# EAGLE design APRS (EAGLE 6.2)
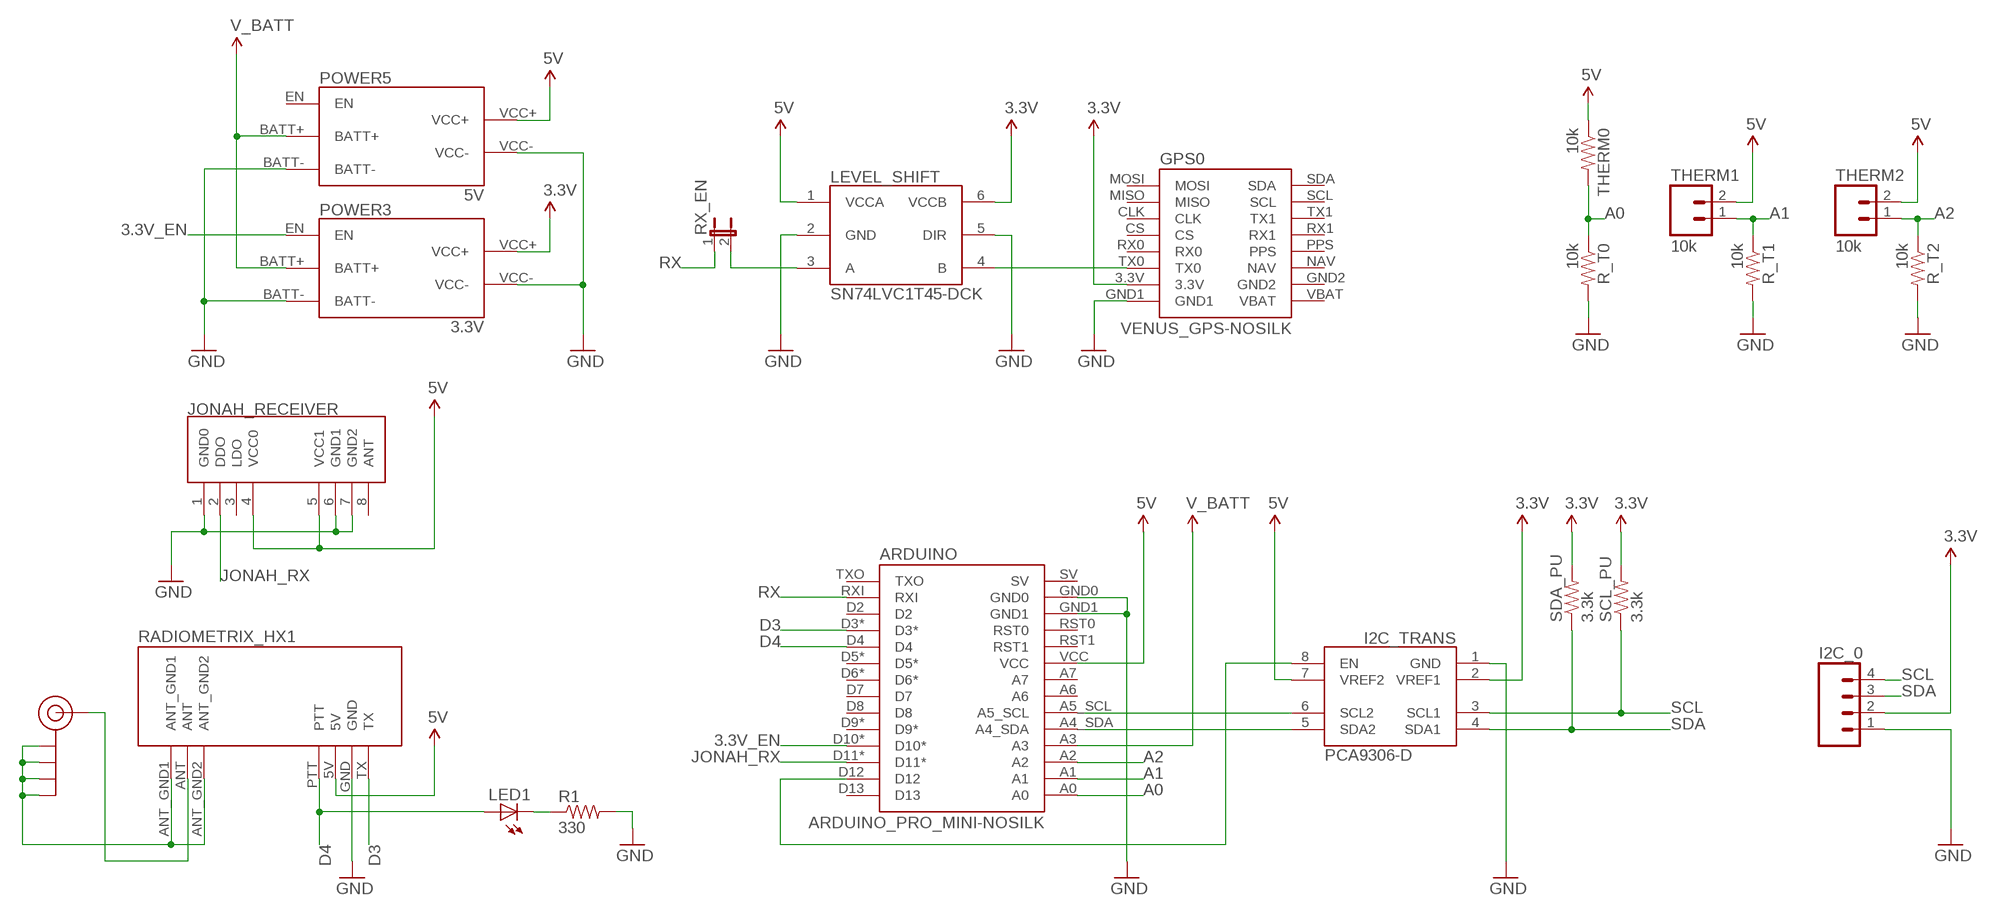
[diagram p0: schematic, sheet 1]

## Parts
ARDUINO  ARDUINO_PRO_MINI-NOSILK  [ARDUINO_PRO_MINI-NOSILK]
GPS0  VENUS_GPS-NOSILK  [VENUS_GPS-NOSILK]
I2C_0  M04PTH  [1X04]
I2C_TRANS  PCA9306-D  [SO8]
J$1  SMA_EDGE  [SMA-EDGE]
JONAH_RECEIVER  RADIO-KLP-RECEIVER-NOSILK  [RADIO-KLP-RECEIVER-NOSILK]
LED1  LED0603  [LED-0603]
LEVEL_SHIFT  SN74LVC1T45-DCK  [SC70]
POWER3  3.3V  POWER-TPS6300X-NOSILK  [POWER-TPS6300X-NOSILK]
POWER5  5V  POWER-TPS6300X-NOSILK  [POWER-TPS6300X-NOSILK]
R1  330  RESISTOR0805-RES  [0805]
R_T0  10k  RESISTOR0805-RES  [0805]
R_T1  10k  RESISTOR0805-RES  [0805]
R_T2  10k  RESISTOR0805-RES  [0805]
RADIOMETRIX_HX1  RADIOMETRIX-HX1  [RADIOMETRIX-HX1]
RX_EN  JUMPER-2PTH  [1X02]
SCL_PU  3.3k  RESISTOR0805-RES  [0805]
SDA_PU  3.3k  RESISTOR0805-RES  [0805]
THERM0  10k  RESISTOR0805-RES  [0805]
THERM1  10k  M02JST-PTH-2  [JST-2-PTH]
THERM2  10k  M02JST-PTH-2  [JST-2-PTH]

## Nets
1.8V: ARDUINO.A3 POWER3.BATT+ POWER5.BATT+ ; supply symbol labelled V_BATT
3.3V: GPS0.3.3V I2C_0.2 I2C_TRANS.2(VREF1) LEVEL_SHIFT.6(VCCB) POWER3.VCC+ SCL_PU.2 SDA_PU.2
3.3V_EN: ARDUINO.D10* POWER3.EN
5V: ARDUINO.VCC I2C_TRANS.7(VREF2) JONAH_RECEIVER.4(VCC0) JONAH_RECEIVER.5(VCC1) LEVEL_SHIFT.1(VCCA) POWER5.VCC+ RADIOMETRIX_HX1.5V THERM0.1 THERM1.2 THERM2.2
A0: ARDUINO.A0 R_T0.1 THERM0.2
A1: ARDUINO.A1 R_T1.1 THERM1.1
A2: ARDUINO.A2 R_T2.1 THERM2.1
D3: ARDUINO.D3* RADIOMETRIX_HX1.TX
D4: ARDUINO.D4 LED1.A RADIOMETRIX_HX1.PTT
GND: ARDUINO.GND0 ARDUINO.GND1 GPS0.GND1 I2C_0.1 I2C_TRANS.1(GND) JONAH_RECEIVER.1(GND0) JONAH_RECEIVER.6(GND1) JONAH_RECEIVER.7(GND2) LEVEL_SHIFT.2(GND) LEVEL_SHIFT.5(DIR) POWER3.BATT- POWER3.VCC- POWER5.BATT- POWER5.VCC- R1.2 R_T0.2 R_T1.2 R_T2.2 RADIOMETRIX_HX1.GND
JONAH_RX: ARDUINO.D11* JONAH_RECEIVER.2(DDO)
N$1: J$1.GND@0(GND) J$1.GND@1(GND) J$1.GND@2(GND) J$1.GND@3(GND) RADIOMETRIX_HX1.ANT_GND1 RADIOMETRIX_HX1.ANT_GND2
N$2: J$1.SIG(SIGNAL) RADIOMETRIX_HX1.ANT
N$3: GPS0.TX0 LEVEL_SHIFT.4(B)
N$4: ARDUINO.A4_SDA I2C_TRANS.5(SDA2)
N$5: ARDUINO.A5_SCL I2C_TRANS.6(SCL2)
N$6: ARDUINO.D12 I2C_TRANS.8(EN)
N$7: LEVEL_SHIFT.3(A) RX_EN.2
N$11: LED1.C R1.1
RX: ARDUINO.RXI RX_EN.1
SCL: I2C_0.4 I2C_TRANS.3(SCL1) SCL_PU.1
SDA: I2C_0.3 I2C_TRANS.4(SDA1) SDA_PU.1
Unconnected: ARDUINO.A6 ARDUINO.A7 ARDUINO.D2 ARDUINO.D5* ARDUINO.D6* ARDUINO.D7 ARDUINO.D8 ARDUINO.D9* ARDUINO.D13 ARDUINO.RST0 ARDUINO.RST1 ARDUINO.SV ARDUINO.TXO GPS0.CLK GPS0.CS GPS0.GND2 GPS0.MISO GPS0.MOSI GPS0.NAV GPS0.PPS GPS0.RX0 GPS0.RX1 GPS0.SCL GPS0.SDA GPS0.TX1 GPS0.VBAT JONAH_RECEIVER.3(LDO) JONAH_RECEIVER.8(ANT) POWER5.EN

## Library data of the parts
ARDUINO = OpenSpace:ARDUINO_PRO_MINI
GPS0 = OpenSpace:VENUS_GPS
I2C_0 = SparkFun-Connectors:M04: Header 4 Standard 4-pin 0.1" header. Use with straight break away headers (SKU : PRT-00116), right angle break away headers (PRT-00553), swiss pins (PRT-00743), machine pins (PRT-00117), and female headers (PRT-00115). Molex polarized connector foot print use with SKU : PRT-08231 with associated crimp pins and housings. 1MM SMD Version SKU: PRT-10208
I2C_TRANS = OpenSpace:PCA9306
J$1 = SparkFun:SMA_EDGE: SMA Antenna Connector End launch SMA connector. The paste layer has been removed so that the connector can be hand soldered onto the board after reflow.
JONAH_RECEIVER = OpenSpace:RADIO-KLP-RECEIVER
LED1 = SparkFun-LED:LED: LEDs Standard schematic elements and footprints for 5mm, 3mm, 1206, and 0603 sized LEDs. 5mm - Spark Fun Electronics SKU : COM-00529 (and others)
LEVEL_SHIFT = OpenSpace:SN74LVC1T45
POWER3 POWER5 = OpenSpace:POWER
R1 R_T0 R_T1 R_T2 SCL_PU SDA_PU THERM0 = SparkFun-Passives:RESISTOR: Resistor Basic schematic elements and footprints for 0603, 1206, and PTH resistors.
RADIOMETRIX_HX1 = OpenSpace:RADIOMETRIX-HX1
RX_EN = SparkFun-Passives:JUMPER-2: Jumper Basic 0.1" spaced jumper. Use with breakaway headers.
THERM1 THERM2 = SparkFun-Connectors:M02: Header 2 Standard 2-pin 0.1" header. Use with straight break away headers (SKU : PRT-00116), right angle break away headers (PRT-00553), swiss pins (PRT-00743), machine pins (PRT-00117), and female headers (PRT-00115). Molex polarized connector foot print use with SKU : PRT-08233 with associated crimp pins and housings.

## Board
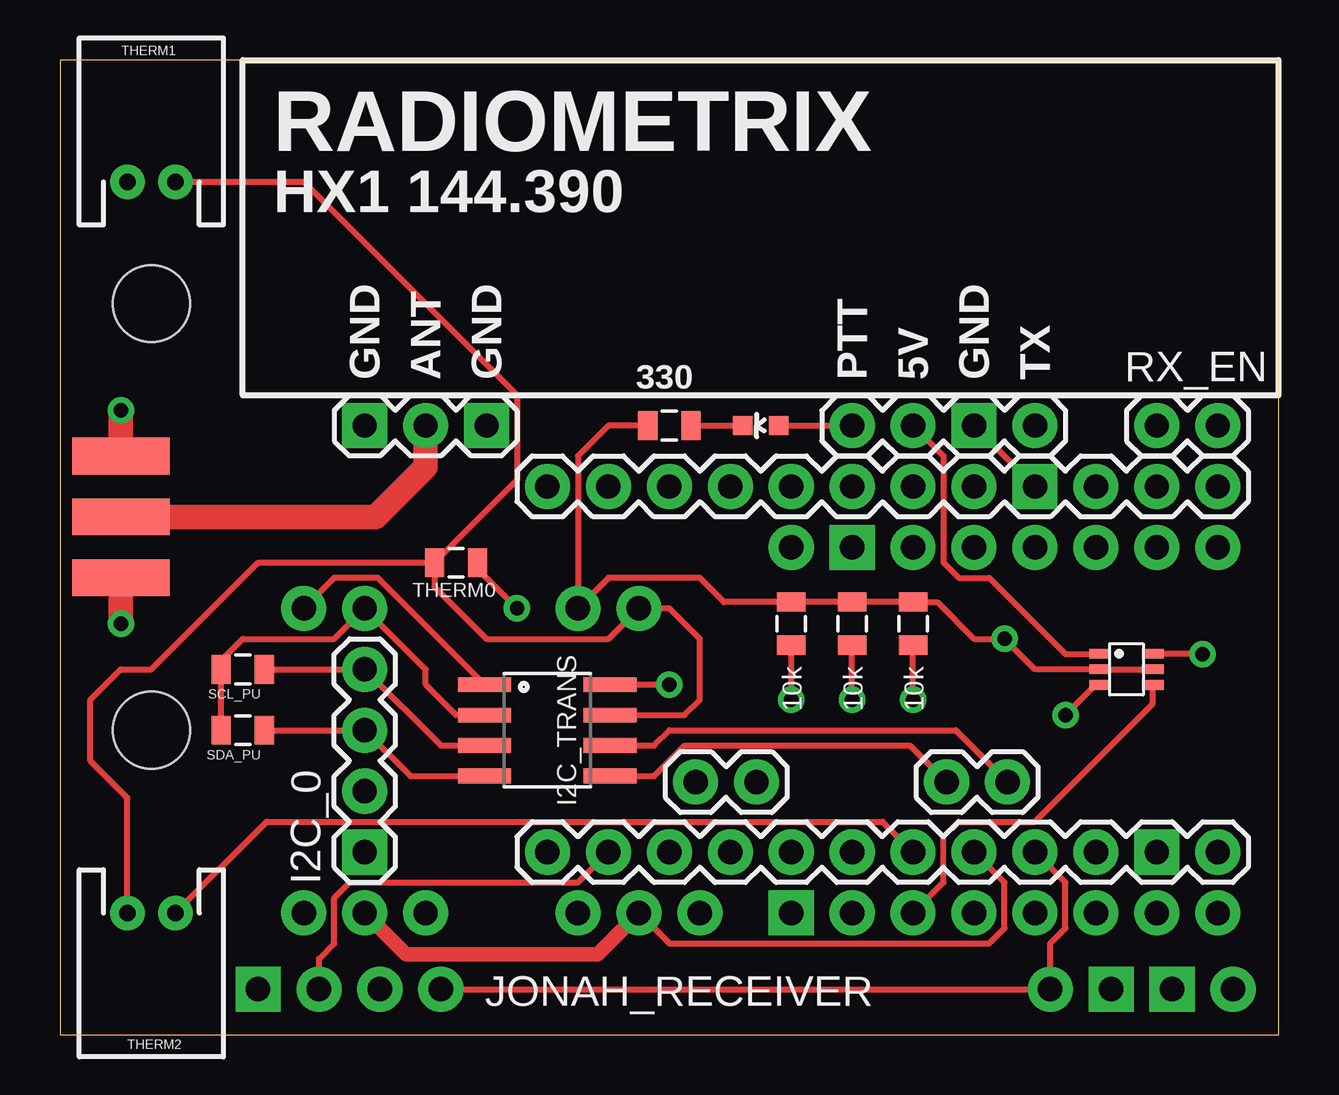
[diagram p1: board, top side]
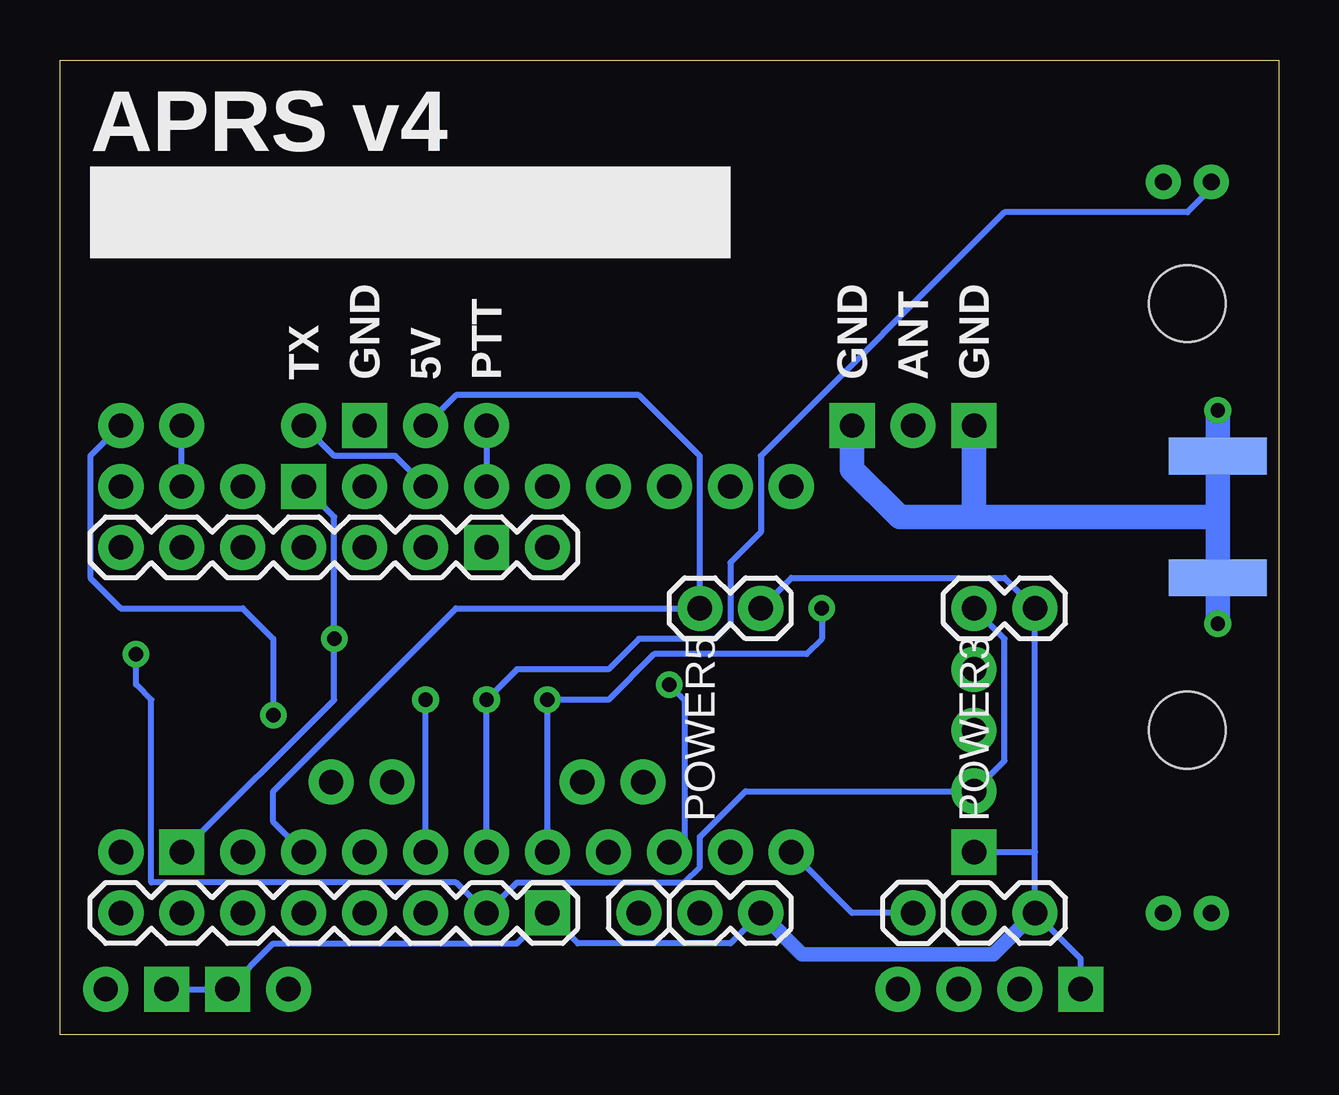
[diagram p2: board, bottom side, seen from below]

Size 50.8 x 40.64 mm. Coordinates in mm from the lower left corner, seen from the top.
Outline: 0,0 50.8,0 50.8,40.64 0,40.64 0,0
Copper layers (1*16): Top 0.035mm / dielectric 1.5mm / Bottom 0.035mm
Design rules: minimum track width 8mil, minimum drill 20mil, track to track 8mil, track to pad 8mil, pad to pad 8mil, via to via 8mil, smd to smd 8mil, copper to edge 10mil, drill to drill 8mil, minimum pad ring 12mil, minimum via ring 10mil, stop-mask expansion 4mil, vias tented up to drill 25mil, thermal gap 10mil
Holes 3.2 mm at 3.81,30.48 3.81,12.7

### Footprints (pad centres in the part's own frame; a part is rotated, then mirrored left to right if it is on the bottom)
ARDUINO_PRO_MINI-NOSILK = drill 1.016 pad 1.88: A0 7.62,-3.81; A1 7.62,-1.27; A2 7.62,1.27; A3 7.62,3.81; A4_SDA 4.699,2.667; A5_SCL 4.699,5.207; A6 4.699,-7.798; A7 4.699,-5.258; D2 -7.62,3.81; D3* -7.62,1.27; D4 -7.62,-1.27; D5* -7.62,-3.81; D6* -7.62,-6.35; D7 -7.62,-8.89; D8 -7.62,-11.43; D9* -7.62,-13.97; D10* 7.62,-13.97; D11* 7.62,-11.43; D12 7.62,-8.89; D13 7.62,-6.35; RST0 -7.62,8.89; RST1 7.62,8.89; RXI -7.62,11.43; SV 7.62,13.97; TXO -7.62,13.97; VCC 7.62,6.35 | drill 1.016 pad 1.88 square: GND0 -7.62,6.35; GND1 7.62,11.43
VENUS_GPS-NOSILK = drill 1.016 pad 1.88: 3.3V -7.62,-6.35; CLK -7.62,3.81; CS -7.62,1.27; MISO -7.62,6.35; MOSI -7.62,8.89; NAV 7.62,-3.81; PPS 7.62,-1.27; RX0 -7.62,-1.27; RX1 7.62,1.27; SCL 7.62,6.35; SDA 7.62,8.89; TX0 -7.62,-3.81; TX1 7.62,3.81; VBAT 7.62,-8.89 | drill 1.016 pad 1.88 square: GND1 -7.62,-8.89; GND2 7.62,-6.35
1X04 = drill 1.016 pad 1.88 square: 1 0,0 | drill 1.016 pad 1.88: 2 2.54,0; 3 5.08,0; 4 7.62,0
SO8 = smd 0.61 x 2.21: 1 -1.905,-2.616; 2 -0.635,-2.616; 3 0.635,-2.616; 4 1.905,-2.616; 5 1.905,2.616; 6 0.635,2.616; 7 -0.635,2.616; 8 -1.905,2.616
SMA-EDGE = smd 1.524 x 4.064: GND@0 0,0; GND@1 5.08,0; SIG 2.54,0 | smd 1.524 x 4.064 bottom: GND@2 0,0; GND@3 5.08,0
RADIO-KLP-RECEIVER-NOSILK = drill 1.016 pad 1.88 square: 1 -20.32,0; 6 15.24,0; 7 17.78,0 | drill 1.016 pad 1.88: 2 -17.78,0; 3 -15.24,0; 4 -12.7,0; 5 12.7,0; 8 20.32,0
LED-0603 = smd 0.8 x 0.8: A 0,-0.75; C 0,0.75
SC70 = smd 0.4 x 0.9: 1 -0.65,-1.1; 2 0,-1.1; 3 0.65,-1.1; 4 0.65,1.1; 5 0,1.1; 6 -0.65,1.1
POWER-TPS6300X-NOSILK = drill 1.016 pad 1.88: BATT+ -2.54,1.27; BATT- -2.54,-1.27; EN -2.54,3.81; VCC+ 10.16,1.27; VCC- 10.16,-1.27
0805 = smd 0.8 x 1.2: 1 -0.9,0; 2 0.9,0
RADIOMETRIX-HX1 = drill 1.016 pad 1.88: 5V 6.35,-7.62; ANT -13.97,-7.62; PTT 3.81,-7.62; TX 11.43,-7.62 | drill 1.016 pad 1.88 square: ANT_GND1 -16.51,-7.62; ANT_GND2 -11.43,-7.62; GND 8.89,-7.62
1X02 = drill 1.016 pad 1.88: 1 0,0; 2 2.54,0
JST-2-PTH = drill 0.7 pad 1.448: 1 -1,0; 2 1,0

### Placement (x,y rotation side)
ARDUINO  34.29,15.24 270 top
GPS0  39.37,12.7 90 bottom
I2C_0  12.7,7.62 90 top
I2C_TRANS  20.32,12.7 270 top
J$1  2.54,24.13 270 top
JONAH_RECEIVER  28.57,1.91 0 top
LED1  29.21,25.4 90 top
LEVEL_SHIFT  44.45,15.24 270 top
POWER3  11.43,7.62 90 bottom
POWER5  22.86,7.62 90 bottom
R1  25.4,25.4 180 top
R_T0  30.48,17.14 90 top
R_T1  33.02,17.14 90 top
R_T2  35.56,17.14 90 top
RADIOMETRIX_HX1  29.21,33.02 0 top
RX_EN  45.72,25.4 0 top
SCL_PU  7.62,15.24 180 top
SDA_PU  7.62,12.7 180 top
THERM0  16.51,19.68 0 top
THERM1  3.81,35.56 0 top
THERM2  3.81,5.08 180 top

### Tracks (layer width: path | path; a pad name or v marks a point on that pad's centre or on a via)
1.8V
  Top 0.254: POWER5.BATT+ 25.4,3.81 38.73,3.81 39.37,4.45 39.37,6.35 ARDUINO.A3
  Top 0.61: POWER5.BATT+ 22.4,3.35 14.43,3.35 POWER3.BATT+
3.3V  (via drill 0.6)
  Top 0.254: I2C_TRANS.2 16.51,13.34 15.24,14.61 15.24,15.24 POWER3.VCC+ 11.43,16.51 7.62,16.51 6.72,15.61 SCL_PU.2 SDA_PU.2 | v47.62,15.88 v47.61,15.89 LEVEL_SHIFT.6
  Bottom 0.254: POWER3.VCC+ 11.43,16.51 11.43,11.43 I2C_0.2 22.23,10.16 24.13,8.26 24.13,6.99 24.77,6.35 31.75,6.35 GPS0.3.3V 34.29,6.35 46.99,6.35 46.99,13.97 47.62,14.61 v47.62,15.88
3.3V_EN
  Bottom 0.254: POWER3.EN 17.78,5.08 ARDUINO.D10*
5V
  Top 0.254: I2C_TRANS.7 26.04,13.34 26.67,13.97 26.67,16.51 25.4,17.78 POWER5.VCC+ 22.86,16.51 17.78,16.51 15.61,18.68 THERM0.1 | THERM2.2 2.81,9.89 1.27,11.43 1.27,13.97 2.54,15.24 3.81,15.24 8.26,19.68 THERM0.1 | THERM1.2 10.16,35.56 19.05,26.67 19.05,23.12 THERM0.1 | RADIOMETRIX_HX1.5V 36.83,24.13 36.83,19.68 37.47,19.05 38.73,19.05 41.91,15.88 43.34,15.88 LEVEL_SHIFT.1 | JONAH_RECEIVER.4 JONAH_RECEIVER.5 41.27,3.81 41.91,4.45 41.91,6.35 ARDUINO.VCC
  Bottom 0.254: RADIOMETRIX_HX1.5V 34.29,26.67 26.67,26.67 24.13,24.13 POWER5.VCC+ 34.29,17.78 41.91,10.16 41.91,8.89 ARDUINO.VCC
A0  (via drill 0.6)
  Top 0.254: v30.48,13.97 R_T0.1 | THERM0.2 17.41,19.42 v19.05,17.78
  Bottom 0.254: ARDUINO.A0 v30.48,13.97 27.94,13.97 26.04,15.88 19.68,15.88 19.05,16.51 v19.05,17.78
A1  (via drill 0.6)
  Top 0.254: v33.02,13.97 R_T1.1
  Bottom 0.254: ARDUINO.A1 v33.02,13.97 31.75,15.24 27.94,15.24 26.67,16.51 23.5,16.51 22.86,17.14 22.86,19.68 21.59,20.95 21.59,24.13 11.43,34.29 3.81,34.29 2.81,35.29 THERM1.1
A2  (via drill 0.6)
  Top 0.254: v35.56,13.97 R_T2.1 | THERM2.1 8.62,8.89 34.29,8.89 ARDUINO.A2
  Bottom 0.254: ARDUINO.A2 v35.56,13.97
D3
  Bottom 0.254: ARDUINO.D3* 36.83,24.13 39.37,24.13 RADIOMETRIX_HX1.TX
D4
  Top 0.254: LED1.A RADIOMETRIX_HX1.PTT
  Bottom 0.254: RADIOMETRIX_HX1.PTT ARDUINO.D4
GND  (via drill 0.6)
  Top 0.254: I2C_TRANS.1 13.26,19.05 11.43,19.05 POWER3.VCC- | ARDUINO.GND0 RADIOMETRIX_HX1.GND | LEVEL_SHIFT.5 LEVEL_SHIFT.2 40.64,15.24 v39.37,16.51 38.1,16.51 36.56,18.05 R_T2.2 R_T1.2 R_T0.2 27.68,18.05 26.67,19.05 22.86,19.05 POWER5.VCC- 21.59,24.13 22.86,25.4 R1.2
  Bottom 0.254: 10.16,7.62 POWER3.BATT- 8.26,3.17 JONAH_RECEIVER.1 | 10.16,7.62 POWER3.VCC- 11.43,19.05 20.32,19.05 POWER5.VCC- | I2C_0.1 10.16,7.62 | POWER5.BATT- 22.86,3.81 29.21,3.81 GPS0.GND1 31.75,3.81 41.91,3.81 JONAH_RECEIVER.6 JONAH_RECEIVER.7 | ARDUINO.GND0 39.37,21.59 v39.37,16.51 39.37,13.97 ARDUINO.GND1
  Bottom 0.61: POWER3.BATT- 11.89,3.35 19.86,3.35 POWER5.BATT-
JONAH_RX
  Top 0.254: JONAH_RECEIVER.2 10.79,3.17 11.43,3.81 11.43,5.71 12.06,6.35 21.59,6.35 ARDUINO.D11*
N$1  (via drill 0.6)
  Top 1.016: J$1.GND@2 v2.54,26.04 | v2.54,17.14 J$1.GND@3
  Bottom 1.016: RADIOMETRIX_HX1.ANT_GND2 17.78,23.57 15.8,21.59 12.7,21.59 | 12.7,21.59 2.54,21.59 | 2.54,21.59 J$1.GND@3 v2.54,17.14 | 2.54,21.59 J$1.GND@2 v2.54,26.04 | RADIOMETRIX_HX1.ANT_GND1 12.7,21.59
N$2
  Top 1.016: RADIOMETRIX_HX1.ANT 15.24,23.67 13.16,21.59 J$1.SIG
N$3
  Top 0.254: GPS0.TX0 36.83,6.35 36.83,8.26 37.47,8.89 40.64,8.89 45.55,13.8 LEVEL_SHIFT.4
N$4
  Top 0.254: I2C_TRANS.5 24.77,10.79 26.04,12.06 35.43,12.06 ARDUINO.A4_SDA
N$5
  Top 0.254: I2C_TRANS.6 24.77,12.06 25.4,12.7 37.34,12.7 ARDUINO.A5_SCL
N$6  (via drill 0.6)
  Top 0.254: I2C_TRANS.8 v25.4,14.61
  Bottom 0.254: v25.4,14.61 24.77,13.97 24.77,8.26 ARDUINO.D12
N$7  (via drill 0.6)
  Top 0.254: v41.91,13.34 43.16,14.59 LEVEL_SHIFT.3
  Bottom 0.254: RX_EN.2 49.53,24.13 49.53,19.05 48.26,17.78 43.18,17.78 41.91,16.51 v41.91,13.34
N$11
  Top 0.254: R1.1 LED1.C
RX
  Bottom 0.254: ARDUINO.RXI RX_EN.1
SCL
  Top 0.254: SCL_PU.1 I2C_0.4 15.88,12.06 I2C_TRANS.3
SDA
  Top 0.254: SDA_PU.1 I2C_0.3 14.61,10.79 I2C_TRANS.4

### Text on the board
bPlace: APRS v4